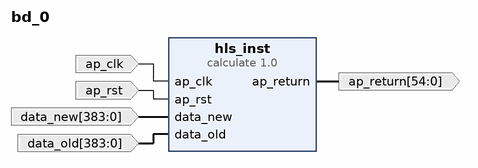
[diagram p0: block diagram of the top level]
# Vivado block design bd_0, xc7z020clg400-2, Vivado 2024.1
create_bd_design bd_0

create_bd_port -dir I -type clk ap_clk
set_property -dict {CONFIG.FREQ_HZ 400000000.0} [get_bd_ports ap_clk]
create_bd_port -dir O -from 54 -to 0 -type data ap_return
create_bd_port -dir I -type rst ap_rst
set_property -dict {CONFIG.POLARITY ACTIVE_HIGH} [get_bd_ports ap_rst]
create_bd_port -dir I -from 383 -to 0 -type data data_new
create_bd_port -dir I -from 383 -to 0 -type data data_old

create_bd_cell -type ip -vlnv xilinx.com:hls:calculate:1.0 hls_inst

# ---- connections ----

connect_bd_net -net ap_clk_0_1 [get_bd_ports ap_clk] [get_bd_pins hls_inst/ap_clk]
connect_bd_net -net ap_rst_0_1 [get_bd_ports ap_rst] [get_bd_pins hls_inst/ap_rst]
connect_bd_net -net data_new_0_1 [get_bd_ports data_new] [get_bd_pins hls_inst/data_new]
connect_bd_net -net data_old_0_1 [get_bd_ports data_old] [get_bd_pins hls_inst/data_old]
connect_bd_net [get_bd_pins hls_inst/ap_return] [get_bd_ports ap_return]

validate_bd_design
save_bd_design
